# Altium schematic sheet MainBoard_Top.SchDoc
size C
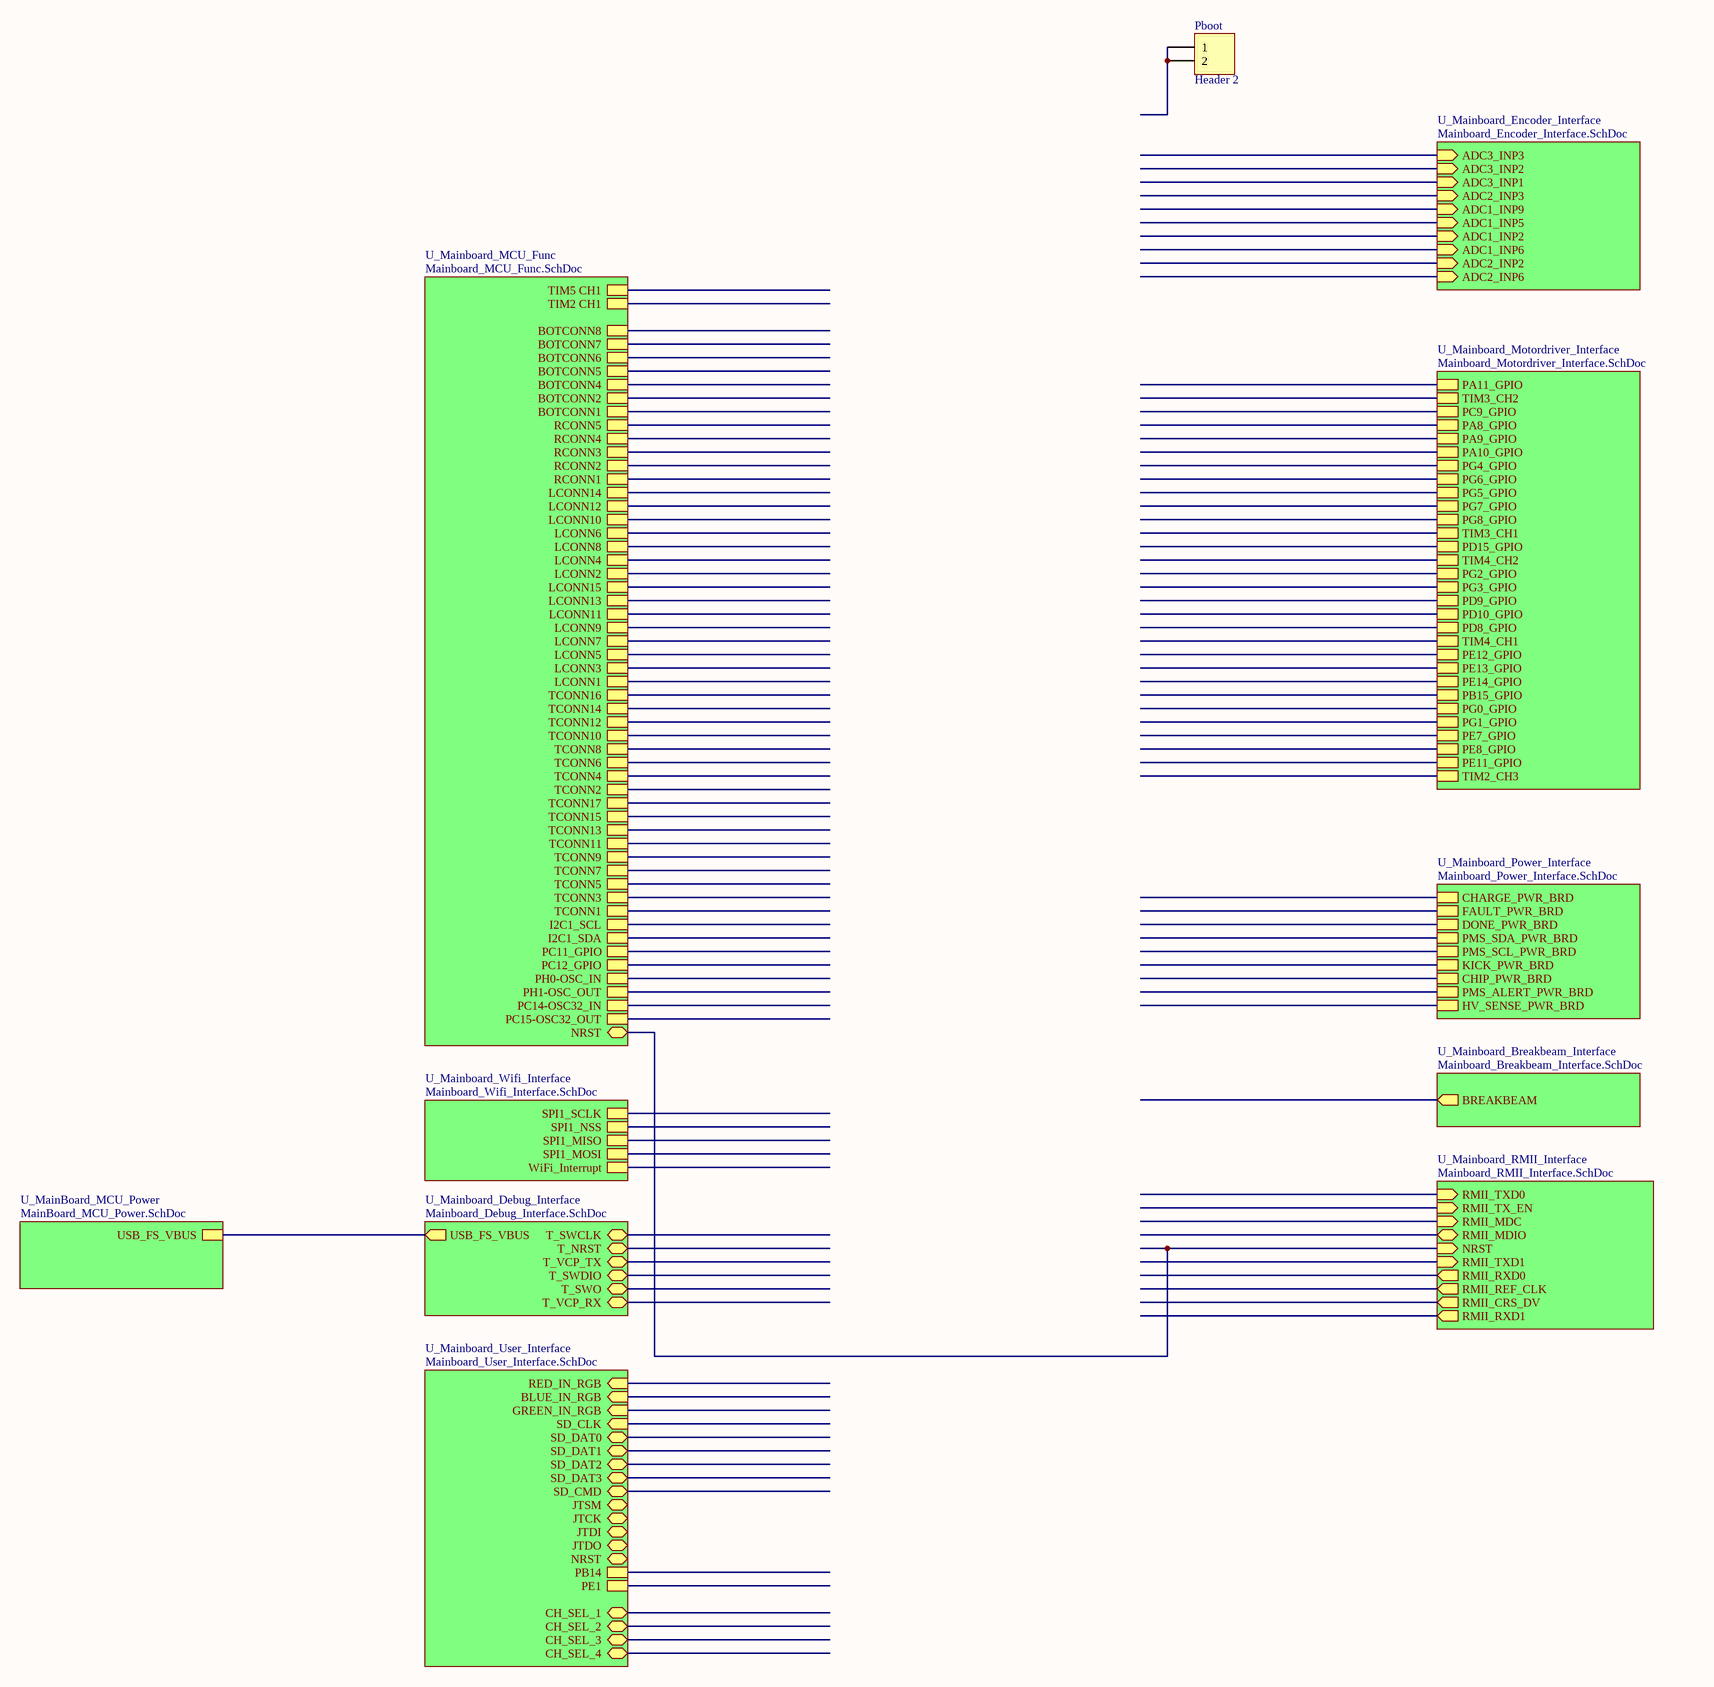
[diagram p0: MainBoard_Top.SchDoc]

## Parts
Pboot  Header 2  [HDR1X2]

## Sub-sheets
U_Mainboard_Breakbeam_Interface = Mainboard_Breakbeam_Interface.SchDoc: BREAKBEAM (out)
U_Mainboard_Debug_Interface = Mainboard_Debug_Interface.SchDoc: USB_FS_VBUS (out), T_SWCLK (bidir), T_NRST (bidir), T_VCP_TX (bidir), T_SWDIO (bidir), T_SWO (bidir), T_VCP_RX (bidir)
U_Mainboard_Encoder_Interface = Mainboard_Encoder_Interface.SchDoc: ADC3_INP3 (in), ADC3_INP2 (in), ADC3_INP1 (in), ADC2_INP3 (in), ADC1_INP9 (in), ADC1_INP5 (in), ADC1_INP2 (in), ADC1_INP6 (in), ADC2_INP2 (in), ADC2_INP6 (in)
U_Mainboard_MCU_Func = Mainboard_MCU_Func.SchDoc: NRST (bidir), TIM5 CH1, TIM2 CH1, BOTCONN8, BOTCONN7, BOTCONN6, BOTCONN5, BOTCONN4, BOTCONN2, BOTCONN1, RCONN5, RCONN4, RCONN3, RCONN2, RCONN1, LCONN14, LCONN12, LCONN10, LCONN6, LCONN8, LCONN4, LCONN2, LCONN15, LCONN13, LCONN11, LCONN9, LCONN7, LCONN5, LCONN3, LCONN1, TCONN16, TCONN14, TCONN12, TCONN10, TCONN8, TCONN6, TCONN4, TCONN2, TCONN17, TCONN15, TCONN13, TCONN11, TCONN9, TCONN7, TCONN5, TCONN3, TCONN1, I2C1_SCL, I2C1_SDA, PC11_GPIO, PC12_GPIO, PH0-OSC_IN, PH1-OSC_OUT, PC14-OSC32_IN, PC15-OSC32_OUT
U_MainBoard_MCU_Power = MainBoard_MCU_Power.SchDoc: USB_FS_VBUS
U_Mainboard_Motordriver_Interface = Mainboard_Motordriver_Interface.SchDoc: PA11_GPIO, TIM3_CH2, PC9_GPIO, PA8_GPIO, PA9_GPIO, PA10_GPIO, PG4_GPIO, PG6_GPIO, PG5_GPIO, PG7_GPIO, PG8_GPIO, TIM3_CH1, PD15_GPIO, TIM4_CH2, PG2_GPIO, PG3_GPIO, PD9_GPIO, PD10_GPIO, PD8_GPIO, TIM4_CH1, PE12_GPIO, PE13_GPIO, PE14_GPIO, PB15_GPIO, PG0_GPIO, PG1_GPIO, PE7_GPIO, PE8_GPIO, PE11_GPIO, TIM2_CH3
U_Mainboard_Power_Interface = Mainboard_Power_Interface.SchDoc: CHARGE_PWR_BRD, FAULT_PWR_BRD, DONE_PWR_BRD, PMS_SDA_PWR_BRD, PMS_SCL_PWR_BRD, KICK_PWR_BRD, CHIP_PWR_BRD, PMS_ALERT_PWR_BRD, HV_SENSE_PWR_BRD
U_Mainboard_RMII_Interface = Mainboard_RMII_Interface.SchDoc: RMII_TXD0 (in), RMII_TX_EN (in), RMII_RXD0 (out), RMII_REF_CLK (out), RMII_CRS_DV (out), RMII_MDC (in), RMII_MDIO (bidir), NRST (in), RMII_TXD1 (in), RMII_RXD1 (out)
U_Mainboard_User_Interface = Mainboard_User_Interface.SchDoc: RED_IN_RGB (in), BLUE_IN_RGB (in), GREEN_IN_RGB (in), SD_CLK (in), SD_DAT0 (bidir), SD_DAT1 (bidir), SD_DAT2 (bidir), SD_DAT3 (bidir), SD_CMD (bidir), JTSM (bidir), JTCK (bidir), JTDI (bidir), JTDO (bidir), NRST (bidir), PB14, PE1, CH_SEL_1 (bidir), CH_SEL_2 (bidir), CH_SEL_3 (bidir), CH_SEL_4 (bidir)
U_Mainboard_Wifi_Interface = Mainboard_Wifi_Interface.SchDoc: SPI1_SCLK, SPI1_NSS, SPI1_MISO, SPI1_MOSI, WiFi_Interrupt

## Nets
NetPboot_1: Pboot.1 Pboot.2
(unnamed): sheet U_Mainboard_MCU_Func/NRST, sheet U_Mainboard_RMII_Interface/NRST
(unnamed): sheet U_MainBoard_MCU_Power/USB_FS_VBUS, sheet U_Mainboard_Debug_Interface/USB_FS_VBUS

## Library data of the parts
Pboot = Header 2: Header, 2-Pin; LatestRevisionDate: 17-Jul-2002; LatestRevisionNote: Re-released for DXP Platform.; Publisher: Altium Limited